# EAGLE design parallelflash (EAGLE 7.5.0)
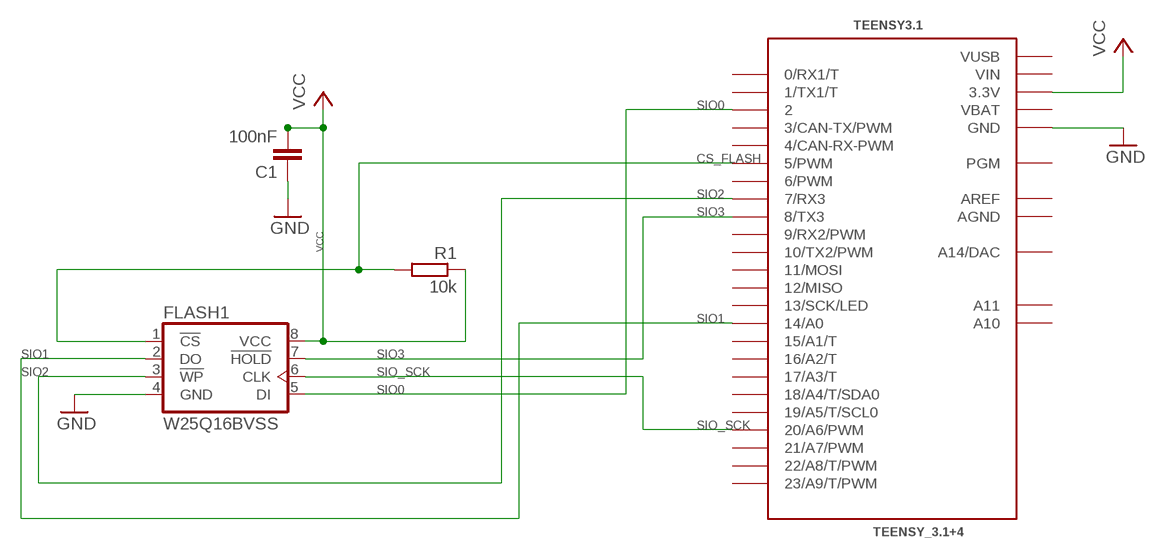
[diagram p0: schematic, sheet 1]

## Parts
C1  100nF  C-EUC0603  [C0603]
FLASH1  W25Q16BVSS  [SO08-SS]
R1  10k  R-EU_R0603  [R0603]
TEENSY3.1  TEENSY_3.1+4  [TEENSY_3.1+4]

## Nets
CS_FLASH: FLASH1.1(!CS!) R1.2 TEENSY3.1.5(5/PWM)
GND [supply]: C1.1 FLASH1.4(GND) TEENSY3.1.GND TEENSY3.1.GND1(GND)
SIO0: FLASH1.5(DI) TEENSY3.1.2
SIO1: FLASH1.2(DO) TEENSY3.1.14/A0
SIO2: FLASH1.3(!WP!) TEENSY3.1.7(7/RX3)
SIO3: FLASH1.7(!HOLD!) TEENSY3.1.8(8/TX3)
SIO_SCK: FLASH1.6(CLK) TEENSY3.1.20/A6(20/A6/PWM)
VCC [supply]: C1.2 FLASH1.8(VCC) R1.1 TEENSY3.1.3.3V TEENSY3.1.3.3V1(3.3V)
Unconnected: TEENSY3.1.0(0/RX1/T) TEENSY3.1.1(1/TX1/T) TEENSY3.1.3(3/CAN-TX/PWM) TEENSY3.1.4(4/CAN-RX-PWM) TEENSY3.1.6(6/PWM) TEENSY3.1.9(9/RX2/PWM) TEENSY3.1.10(10/TX2/PWM) TEENSY3.1.11(11/MOSI) TEENSY3.1.12(12/MISO) TEENSY3.1.13(13/SCK/LED) TEENSY3.1.15/A1(15/A1/T) TEENSY3.1.16/A2(16/A2/T) TEENSY3.1.17/A3(17/A3/T) TEENSY3.1.18/A4(18/A4/T/SDA0) TEENSY3.1.19/A5(19/A5/T/SCL0) TEENSY3.1.21/A7(21/A7/PWM) TEENSY3.1.22/A8(22/A8/T/PWM) TEENSY3.1.23/A9(23/A9/T/PWM) TEENSY3.1.A10 TEENSY3.1.A11 TEENSY3.1.A14(A14/DAC) TEENSY3.1.PGM

## Power pins joined to a net without a drawn wire
AGND: TEENSY3.1.AGND
AREF: TEENSY3.1.AREF
VBAT: TEENSY3.1.VBAT
VIN: TEENSY3.1.VIN
VUSB: TEENSY3.1.VUSB

## Library data of the parts
C1 = rcl:C-EU: CAPACITOR, European symbol
FLASH1 = winbond:W25Q16BV: EEPROM 4 Mbit SPI Serial Flash7
R1 = resistor:R-EU_: RESISTOR, European symbol
TEENSY3.1 = Teensy_3_Series_Board_v1.0:TEENSY_3.1+4: Footprint for Teensy 3.1 board using all through-holes, i.e. the entire perimeter plus the 4 through-holes inboard (A10,A11,AREF, VUSB)

## Net classes
0 default: width 0.254 mm
1 supply: width 0.254 mm
2 signal: width 0.254 mm

## Board
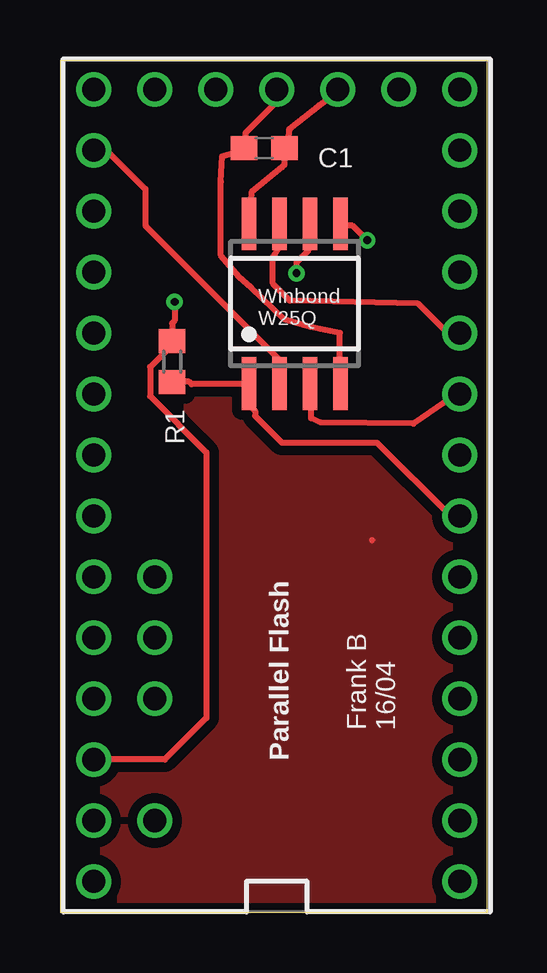
[diagram p1: board, top side]
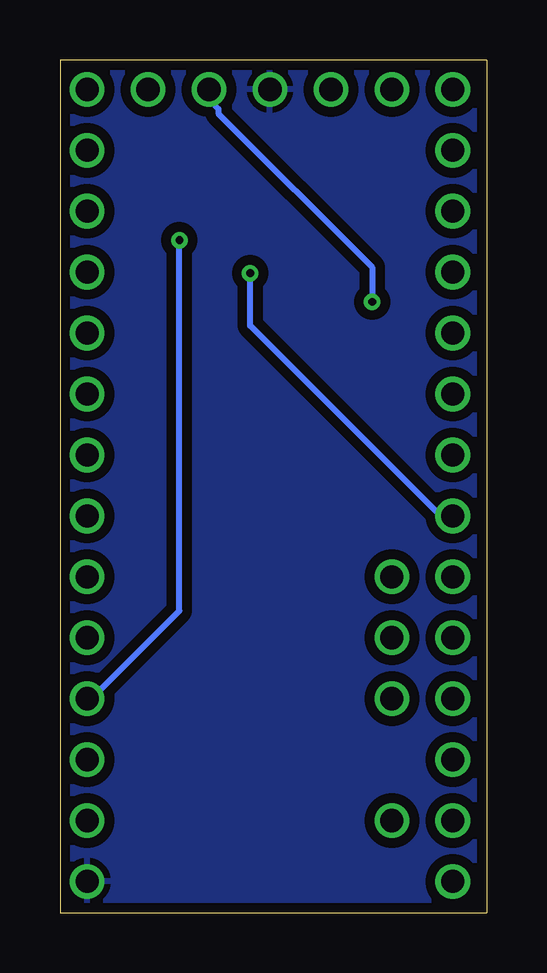
[diagram p2: board, bottom side, seen from below]

Size 17.78 x 35.56 mm. Coordinates in mm from the lower left corner, seen from the top.
Outline: 0,35.56 0,0 17.78,0 17.78,35.56 0,35.56
Copper layers (1*16): Top 0.0356mm / dielectric 1.5011mm / Bottom 0.0356mm
Design rules "MakerWorks *": minimum track width 6mil, minimum drill 13mil, track to track 6mil, track to pad 6mil, pad to pad 6mil, via to via 6mil, smd to smd 6mil, copper to edge 15mil, drill to drill 6mil, minimum pad ring 7mil, minimum via ring 7mil, stop-mask expansion 3mil, vias tented up to drill 0mil, thermal gap 10mil

### Footprints (pad centres in the part's own frame; a part is rotated, then mirrored left to right if it is on the bottom)
C0603 = smd 1.1 x 1: 1 -0.85,0; 2 0.85,0
SO08-SS = smd 0.6 x 2.2: 1 -1.905,-3.33; 2 -0.635,-3.33; 3 0.635,-3.33; 4 1.905,-3.33; 5 1.905,3.33; 6 0.635,3.33; 7 -0.635,3.33; 8 -1.905,3.33
R0603 = smd 1 x 1.1: 1 -0.85,0; 2 0.85,0
TEENSY_3.1+4 = drill 0.965: 0 -7.62,15.24; 1 -7.62,12.7; 2 -7.62,10.16; 3 -7.62,7.62; 3.3V 7.62,12.7; 3.3V1 -2.54,-15.24; 4 -7.62,5.08; 5 -7.62,2.54; 6 -7.62,0; 7 -7.62,-2.54; 8 -7.62,-5.08; 9 -7.62,-7.62; 10 -7.62,-10.16; 11 -7.62,-12.7; 12 -7.62,-15.24; 13 7.62,-15.24; 14/A0 7.62,-12.7; 15/A1 7.62,-10.16; 16/A2 7.62,-7.62; 17/A3 7.62,-5.08; 18/A4 7.62,-2.54; 19/A5 7.62,0; 20/A6 7.62,2.54; 21/A7 7.62,5.08; 22/A8 7.62,7.62; 23/A9 7.62,10.16; A10 5.08,7.62; A11 5.08,5.08; A14 5.08,-15.24; AGND 7.62,15.24; AREF 5.08,10.16; GND -7.62,17.78; GND1 0,-15.24; PGM 2.54,-15.24; VBAT -5.08,-15.24; VIN 7.62,17.78; VUSB 5.08,15.24

### Placement (x,y rotation side)
C1  8.51,31.88 0 top
FLASH1  9.78,25.4 0 top
R1  4.67,22.99 270 top
TEENSY3.1  9.03,19.09 180 top

### Tracks (layer width: path | path; a pad name or v marks a point on that pad's centre or on a via)
CS_FLASH
  Top 0.254: R1.2 5.38,22.15 5.49,22.05 7.82,22.05 FLASH1.1 7.82,21.95 7.82,21.23 8.13,20.93 8.13,20.73 9.25,19.61 13.21,19.61 16.26,16.56 16.56,16.56 TEENSY3.1.5
GND
  Top 0.254: TEENSY3.1.GND1 8.94,34.24 8.94,33.73 7.72,32.51 7.72,31.9 C1.1 7.62,31.8 6.76,31.55 6.71,30.48 6.71,27.41 7.47,26.52 7.98,26.06 9.37,24.74 10.44,24.43 11.66,24.18 11.68,21.54 FLASH1.4
  pour Bottom (isolate 0.406): 0,35.56 17.78,35.56 17.78,0 0,0
N$1
  Top 0.254: 13.01,15.54
  pour Top (isolate 0.406): 0,35.56 17.78,35.56 17.78,0 0,0
SIO0  (via drill 0.33)
  Top 0.254: v12.8,28.04 12.19,28.65 11.68,28.65 FLASH1.5
  Bottom 0.254: v12.8,28.04 12.8,12.6 16.56,8.84 TEENSY3.1.2
SIO1
  Top 0.254: FLASH1.2 9.14,23.06 3.56,28.65 3.56,30.18 2.03,31.7 1.42,31.7 TEENSY3.1.14/A0
SIO2
  Top 0.254: FLASH1.3 10.46,22.15 10.46,20.62 10.85,20.45 14.73,20.4 16,21.29 16.66,21.64 16.56,21.64 TEENSY3.1.7
SIO3
  Top 0.254: FLASH1.7 9.14,27.74 8.87,27.33 8.87,26.24 9.58,25.53 14.94,25.4 16.15,24.18 16.56,24.18 TEENSY3.1.8
SIO_SCK  (via drill 0.33)
  Top 0.254: v9.86,26.67 9.86,27.13 10.36,27.64 10.36,28.65 FLASH1.6
  Bottom 0.254: v9.86,26.67 9.86,24.49 1.93,16.56 1.42,16.56 TEENSY3.1.20/A6
VCC  (via drill 0.33)
  Top 0.254: v4.78,25.48 4.78,24.69 4.67,24.59 R1.1 4.78,23.77 3.76,22.76 3.76,21.54 6.1,19.2 6.1,8.13 4.37,6.4 1.42,6.4 TEENSY3.1.3.3V | TEENSY3.1.3.3V1 11.58,34.24 10.82,33.68 9.55,32.66 9.45,31.9 C1.2 9.35,31.8 9.35,31.19 9.25,31.09 7.98,30.05 7.92,29.36 7.92,28.75 FLASH1.8
  Bottom 0.254: v4.78,25.48 4.78,26.92 11.18,33.33 11.18,33.53 11.48,33.83 11.48,34.24 TEENSY3.1.3.3V1

### Text on the board
tNames: Winbond / W25Q | Frank B / 16/04 | Parallel Flash